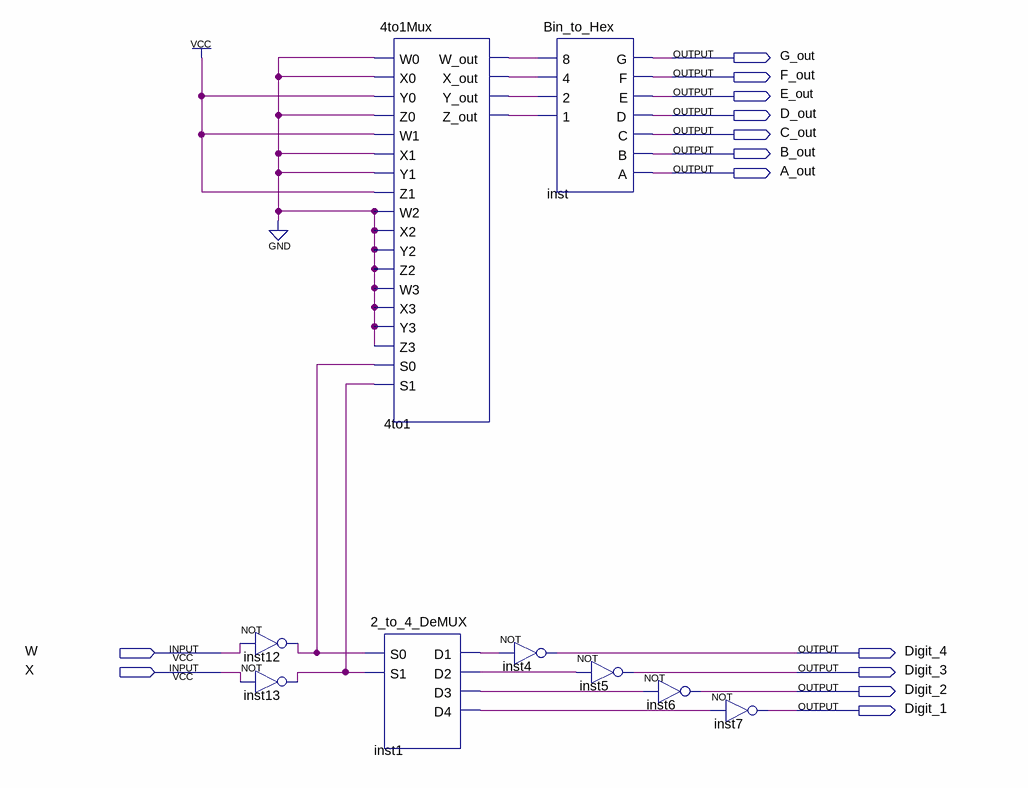
[diagram p0: schematic sheet]
// Quartus schematic lab1.bdf as structural Verilog: 9 symbols, 13 pins
module lab1 (
  input  W,
  input  X,
  output G_out,
  output F_out,
  output E_out,
  output D_out,
  output C_out,
  output B_out,
  output A_out,
  output Digit_4,
  output Digit_3,
  output Digit_2,
  output Digit_1
);

  wire inst1_d1, inst1_d2, inst1_d3, inst1_d4, inst12_out, inst13_out, n4to1_w_out, n4to1_x_out, n4to1_y_out,
       n4to1_z_out;

  not inst12 (inst12_out, W);
  not inst13 (inst13_out, X);
  \4to1Mux  u_4to1 (
    .W0(1'b0), .X0(1'b0), .Y0(1'b1), .Z0(1'b0), .W1(1'b1), .X1(1'b0), .Y1(1'b0), .Z1(1'b1), .W2(1'b0),
    .X2(1'b0), .Y2(1'b0), .Z2(1'b0), .W3(1'b0), .X3(1'b0), .Y3(1'b0), .Z3(1'b0), .S0(inst12_out),
    .S1(inst13_out), .W_out(n4to1_w_out), .X_out(n4to1_x_out), .Y_out(n4to1_y_out), .Z_out(n4to1_z_out));
  \2_to_4_DeMUX  inst1 (.S0(inst12_out), .S1(inst13_out), .D1(inst1_d1), .D2(inst1_d2), .D3(inst1_d3), .D4(inst1_d4));
  Bin_to_Hex inst (
    .\8 (n4to1_w_out), .\4 (n4to1_x_out), .\2 (n4to1_y_out), .\1 (n4to1_z_out), .G(G_out), .F(F_out),
    .E(E_out), .D(D_out), .C(C_out), .B(B_out), .A(A_out));
  not inst4 (Digit_4, inst1_d1);
  not inst5 (Digit_3, inst1_d2);
  not inst6 (Digit_2, inst1_d3);
  not inst7 (Digit_1, inst1_d4);
endmodule
